# EAGLE design airrelay (EAGLE 6.4)

## Sheet 1 of 2
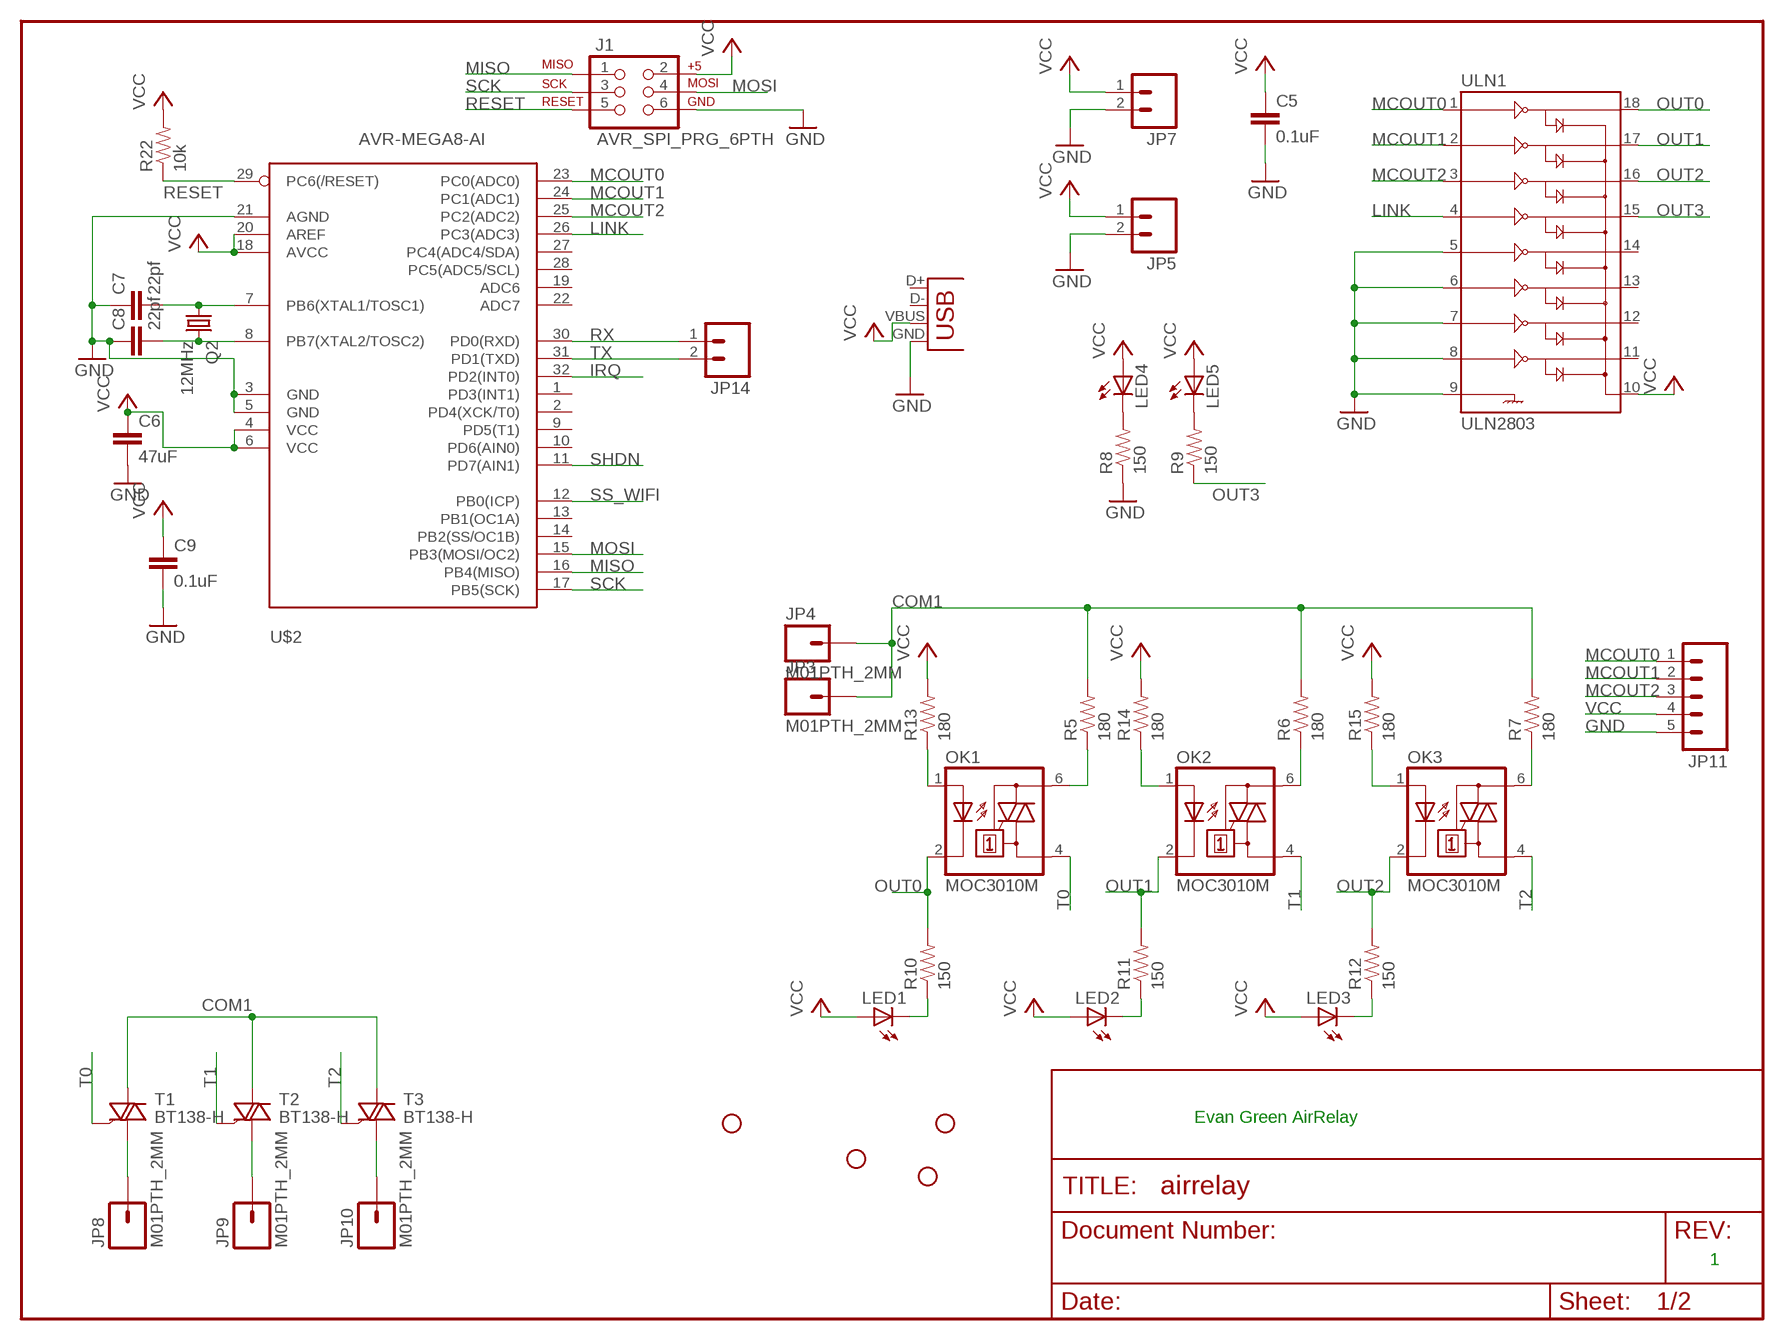
[diagram p0: schematic, sheet 1]

### Parts
C5  0.1uF  CAP0402-CAP  [0402-CAP]
C6  47uF  CAP1210  [1210]
C7  22pf  CAP0402-CAP  [0402-CAP]
C8  22pf  CAP0402-CAP  [0402-CAP]
C9  0.1uF  CAP0402-CAP  [0402-CAP]
J1  AVR_SPI_PRG_6PTH  [2X3]
JP2  STAND-OFF  [STAND-OFF]
JP3  M01PTH_2MM  [1X01_2MM]
JP4  M01PTH_2MM  [1X01_2MM]
JP5  M02PTH  [1X02]
JP6  STAND-OFF  [STAND-OFF]
JP7  M02PTH  [1X02]
JP8  M01PTH_2MM  [1X01_2MM]
JP9  M01PTH_2MM  [1X01_2MM]
JP10  M01PTH_2MM  [1X01_2MM]
JP11  M05PTH  [1X05]
JP12  STAND-OFF  [STAND-OFF]
JP13  STAND-OFF  [STAND-OFF]
JP14  M02PTH  [1X02]
LED1  LED5MM  [LED5MM]
LED2  LED5MM  [LED5MM]
LED3  LED5MM  [LED5MM]
LED4  LED3MM  [LED3MM]
LED5  LED3MM  [LED3MM]
OK1  MOC3010M  [DIL06]
OK2  MOC3010M  [DIL06]
OK3  MOC3010M  [DIL06]
Q2  12MHz  CRYSTALTC38H  [TC38H]
R5  180  RESISTORPTH-1/4W  [AXIAL-0.4]
R6  180  RESISTORPTH-1/4W  [AXIAL-0.4]
R7  180  RESISTORPTH-1/4W  [AXIAL-0.4]
R8  150  RESISTOR0402-RES  [0402-RES]
R9  150  RESISTOR0402-RES  [0402-RES]
R10  150  RESISTOR0402-RES  [0402-RES]
R11  150  RESISTOR0402-RES  [0402-RES]
R12  150  RESISTOR0402-RES  [0402-RES]
R13  180  RESISTOR0402-RES  [0402-RES]
R14  180  RESISTOR0402-RES  [0402-RES]
R15  180  RESISTOR0402-RES  [0402-RES]
R22  10k  RESISTOR0402-RES  [0402-RES]
T1  BT138-H  [TO220BH]
T2  BT138-H  [TO220BH]
T3  BT138-H  [TO220BH]
U$2  AVR-MEGA8-AI  [TQFP32-08]
ULN1  ULN2803  ULN2803SOICW  [SO18L]
X1  USBSMD  [USB-MINIB]

### Nets
COM1 [AC]: JP3.1 JP4.1 R5.P$2 R6.P$2 R7.P$2 T1.T2(A2) T2.T2(A2) T3.T2(A2)
GND: C5.2 C6.2 C7.1 C8.1 C9.2 J1.6 JP5.2 JP7.2 JP11.5 R8.1 U$2.3(GND) U$2.5(GND) U$2.21(AGND) ULN1.5 ULN1.6 ULN1.7 ULN1.8 ULN1.9 X1.GND ; also sheet 2
IRQ: U$2.32(PD2(INT0)) ; also sheet 2
LINK: U$2.26(PC3(ADC3)) ULN1.4
MCOUT0: JP11.1 U$2.23(PC0(ADC0)) ULN1.1
MCOUT1: JP11.2 U$2.24(PC1(ADC1)) ULN1.2
MCOUT2: JP11.3 U$2.25(PC2(ADC2)) ULN1.3
MISO: J1.1 U$2.16(PB4(MISO))
MOSI: J1.4 U$2.15(PB3(MOSI/OC2)) ; also sheet 2
N$1: OK1.1(A) R13.1
N$2: OK2.1(A) R14.1
N$3: OK3.1(A) R15.1
N$4: LED4.K(C) R8.2
N$5: LED5.K(C) R9.2
N$8: LED3.K(C) R12.1
N$9: OK1.6(A2) R5.P$1
N$10: OK2.6(A2) R6.P$1
N$11: OK3.6(A2) R7.P$1
N$14: LED2.K(C) R11.1
N$15: LED1.K(C) R10.1
N$16: C7.2 Q2.1 U$2.7(PB6(XTAL1/TOSC1))
N$21 [AC]: JP8.1 T1.T1(A1)
N$23 [AC]: JP9.1 T2.T1(A1)
N$24 [AC]: JP10.1 T3.T1(A1)
N$28: C8.2 Q2.2 U$2.8(PB7(XTAL2/TOSC2))
OUT0: OK1.2(C) R10.2 ULN1.18
OUT1: OK2.2(C) R11.2 ULN1.17
OUT2: OK3.2(C) R12.2 ULN1.16
OUT3: R9.1 ULN1.15
RESET: J1.5 R22.1 U$2.29(PC6(/RESET))
RX: JP14.1 U$2.30(PD0(RXD))
SCK: J1.3 U$2.17(PB5(SCK)) ; also sheet 2
SHDN: U$2.11(PD7(AIN1)) ; also sheet 2
SS_WIFI: U$2.12(PB0(ICP)) ; also sheet 2
T0: OK1.4(A1) T1.G
T1: OK2.4(A1) T2.G
T2: OK3.4(A1) T3.G
TX: JP14.2 U$2.31(PD1(TXD))
VCC: C5.1 C6.1 C9.1 J1.2 JP5.1 JP7.1 JP11.4 LED1.A LED2.A LED3.A LED4.A LED5.A R13.2 R14.2 R15.2 R22.2 U$2.4(VCC) U$2.6(VCC) U$2.18(AVCC) U$2.20(AREF) ULN1.10 X1.VBUS
Unconnected: U$2.1(PD3(INT1)) U$2.2(PD4(XCK/T0)) U$2.9(PD5(T1)) U$2.10(PD6(AIN0)) U$2.13(PB1(OC1A)) U$2.14(PB2(SS/OC1B)) U$2.19(ADC6) U$2.22(ADC7) U$2.27(PC4(ADC4/SDA)) U$2.28(PC5(ADC5/SCL)) ULN1.11 ULN1.12 ULN1.13 ULN1.14 X1.D+ X1.D-

### Notes on the sheet
- Evan Green AirRelay
- 1

## Sheet 2 of 2
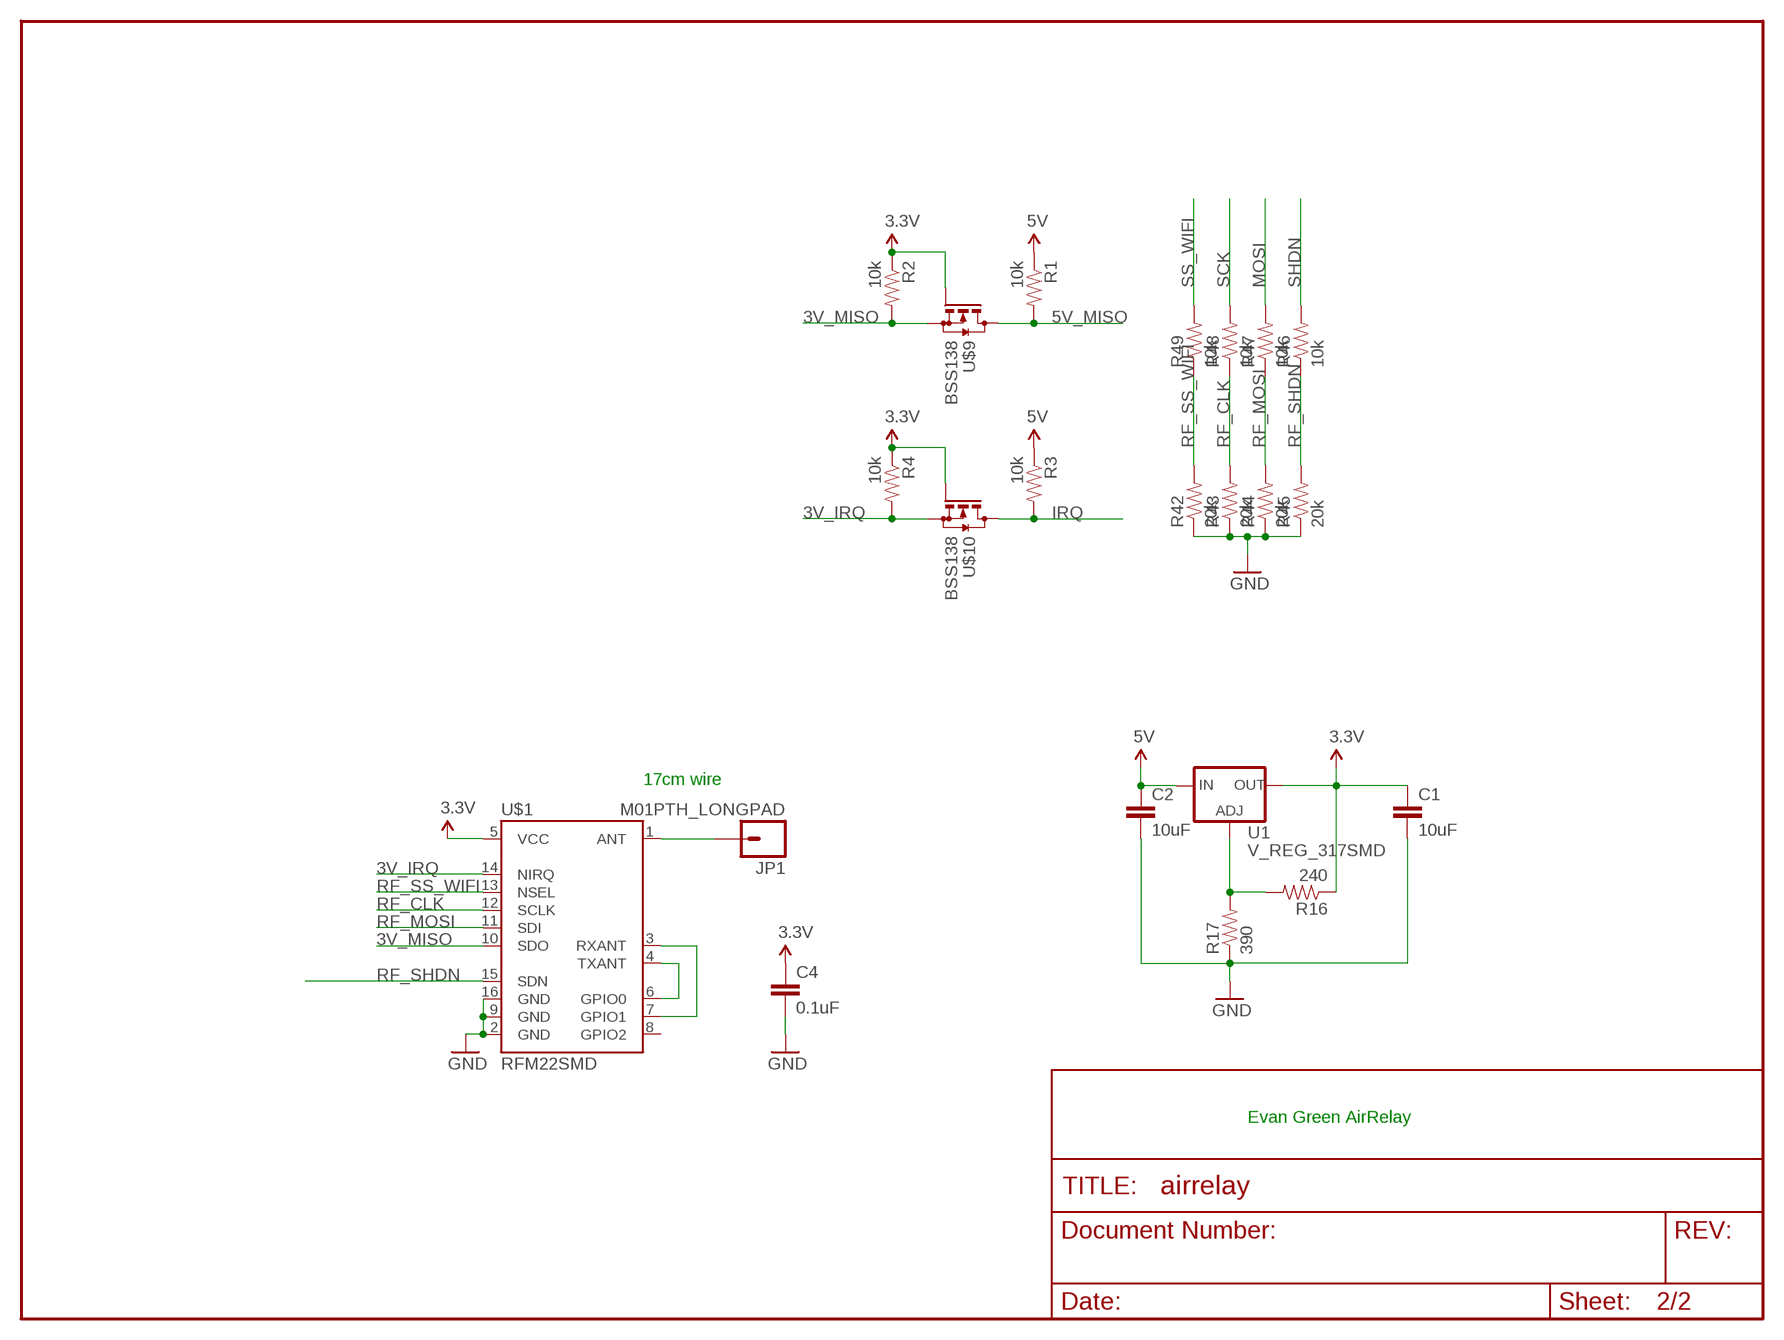
[diagram p1: schematic, sheet 2]

### Parts
C1  10uF  CAP0805  [0805]
C2  10uF  CAP0805  [0805]
C4  0.1uF  CAP0402-CAP  [0402-CAP]
JP1  M01PTH_LONGPAD  [1X01_LONGPAD]
R1  10k  RESISTOR0402-RES  [0402-RES]
R2  10k  RESISTOR0402-RES  [0402-RES]
R3  10k  RESISTOR0402-RES  [0402-RES]
R4  10k  RESISTOR0402-RES  [0402-RES]
R16  240  RESISTOR0402-RES  [0402-RES]
R17  390  RESISTOR0402-RES  [0402-RES]
R42  20k  RESISTOR0402-RES  [0402-RES]
R43  20k  RESISTOR0402-RES  [0402-RES]
R44  20k  RESISTOR0402-RES  [0402-RES]
R45  20k  RESISTOR0402-RES  [0402-RES]
R46  10k  RESISTOR0402-RES  [0402-RES]
R47  10k  RESISTOR0402-RES  [0402-RES]
R48  10k  RESISTOR0402-RES  [0402-RES]
R49  10k  RESISTOR0402-RES  [0402-RES]
U1  V_REG_317SMD  [SOT223]
U$1  RFM22SMD  [RFM22-XXX-S2]
U$9  BSS138  [SOT-323]
U$10  BSS138  [SOT-323]

### Nets
3.3V: C1.1 C4.1 R2.1 R4.1 R16.1 U1.2(OUT) U$1.5(VCC) U$9.1(G) U$10.1(G)
3V_IRQ: R4.2 U$1.14(NIRQ) U$10.2(S)
3V_MISO: R2.2 U$1.10(SDO) U$9.2(S)
5V: C2.1 R1.1 R3.1 U1.3(IN)
5V_MISO: R1.2 U$9.3(D)
GND: C1.2 C2.2 C4.2 R17.1 R42.1 R43.1 R44.1 R45.1 U$1.2(GND) U$1.9(GND) U$1.16(GND) ; also sheet 1
IRQ: R3.2 U$10.3(D) ; also sheet 1
MOSI: R47.2 ; also sheet 1
N$6: R16.2 R17.2 U1.1(ADJ)
N$7: U$1.4(TXANT) U$1.6(GPIO0)
N$12: JP1.1 U$1.1(ANT)
N$22: U$1.3(RXANT) U$1.7(GPIO1)
RF_CLK: R43.2 R48.1 U$1.12(SCLK)
RF_MOSI: R44.2 R47.1 U$1.11(SDI)
RF_SHDN: R45.2 R46.1 U$1.15(SDN)
RF_SS_WIFI: R42.2 R49.1 U$1.13(NSEL)
SCK: R48.2 ; also sheet 1
SHDN: R46.2 ; also sheet 1
SS_WIFI: R49.2 ; also sheet 1
Unconnected: U$1.8(GPIO2)

### Notes on the sheet
- 17cm wire
- Evan Green AirRelay

## Library data of the parts
C1 C2 C4-C9 = SparkFun:CAP: Capacitor Standard 0603 ceramic capacitor, and 0.1" leaded capacitor.
J1 = SparkFun:AVR_SPI_PRG_6: AVR ISP 6 Pin This is the reduced ISP connector for AVR programming. Common on Arduino. This footprint will take up less PCB space and can be used with a 10-pin to 6-pin adapter such as SKU: BOB-08508
JP1 JP3 JP4 JP8-JP10 = SparkFun:M01: Header 1 Standard 1-pin 0.1" header. Use with straight break away headers (SKU : PRT-00116), right angle break away headers (PRT-00553), swiss pins (PRT-00743), machine pins (PRT-00117), and female headers (PRT-00115).
JP2 JP6 JP12 JP13 = SparkFun:STAND-OFF: Stand Off This is the mechanical footprint for a #4 phillips button head screw. Use the keepout ring to avoid running the screw head into surrounding components. SKU : PRT-00447
JP5 JP7 JP14 = SparkFun:M02: Header 2 Standard 2-pin 0.1" header. Use with straight break away headers (SKU : PRT-00116), right angle break away headers (PRT-00553), swiss pins (PRT-00743), machine pins (PRT-00117), and female headers (PRT-00115). Molex polarized connector foot print use with SKU : PRT-08233 with associated crimp pins and housings.
JP11 = SparkFun:M05: Header 5 Standard 5-pin 0.1" header. Use with straight break away headers (SKU : PRT-00116), right angle break away headers (PRT-00553), swiss pins (PRT-00743), machine pins (PRT-00117), and female headers (PRT-00115). Molex polarized connector foot print use with SKU : PRT-08230 with associated crimp pins and housings.
LED1-LED5 = SparkFun:LED: LEDs Standard schematic elements and footprints for 5mm, 3mm, 1206, and 0603 sized LEDs. 5mm - Spark Fun Electronics SKU : COM-00529 (and others)
OK1-OK3 = optocoupler:MOC30*M: RANDOM-PHASE OPTOISOLATORS TRIAC DRIVER OUTPUT Source: http://www.fairchildsemi.com MOC3020-M.pdf; MF: FAIRCHILD SEMICONDUCTOR; MPN: MOC3010-M; OC_FARNELL: 1505423; OC_NEWARK: 72K8892
Q2 = SparkFun:CRYSTAL: Crystals Various standard crystals. Proven footprints. Spark Fun Electronics SKU : COM-00534
R1-R17 R22 R42-R49 = SparkFun:RESISTOR: Resistor Basic schematic elements and footprints for 0603, 1206, and PTH resistors.
T1-T3 = triac:BT138: TRIAC Source: http://www.semiconductors.philips.com BT138_SERIES_2.pdf
U1 = SparkFun:V_REG_317: Voltage Regulator Standard LM317 adjustable voltage regulator. AOI (Adjust Output Input). Google 'LM317 Calculator' for easy to use app to get the two resistor values needed. 240/720 for 5V output. 240/390 for 3.3V output. Spark Fun Electronics SKU : COM-00527
U$1 = SparkFun:RFM22: Description: The RFM22 is a low-power, low cost radio that is capable of operating in the 434MHz and 900MHz open bands. It's frequency is software defined and there are some very good libraries written for it.
U$2 = SparkFun:AVR-MEGA8: MICROCONTROLLER 8 Kbytes FLASH 1 kbytes SRAM 512 bytes EEPROM USART 6-channel 10 bit ADC 2-channel 8 bit ADC
U$9 U$10 = Evan:BSS138: BSS138W N-MOSFET Evan Green 7-Aug-2012
ULN1 = SparkFun:ULN2803: Darlington Driver ULN2803 Darlington array. 500mA max per channel, 8-channel package. Spark Fun Electronics SKU : COM-00312
X1 = SparkFun:USB: USB Connectors USB-B-PTH is fully proven SKU : PRT-00139 USB-miniB is fully proven SKU : PRT-00587 USB-A-PCB is untested. USB-A-H is throughly reviewed, but untested. Spark Fun Electronics SKU : PRT-00437 USB-B-SMT is throughly reviewed, but untested. Needs silkscreen touching up. USB-A-S has not been used/tested USB-MB-H has not been used/tested

## Net classes
1 AC: width 1.524 mm, clearance 0.508 mm

## Board
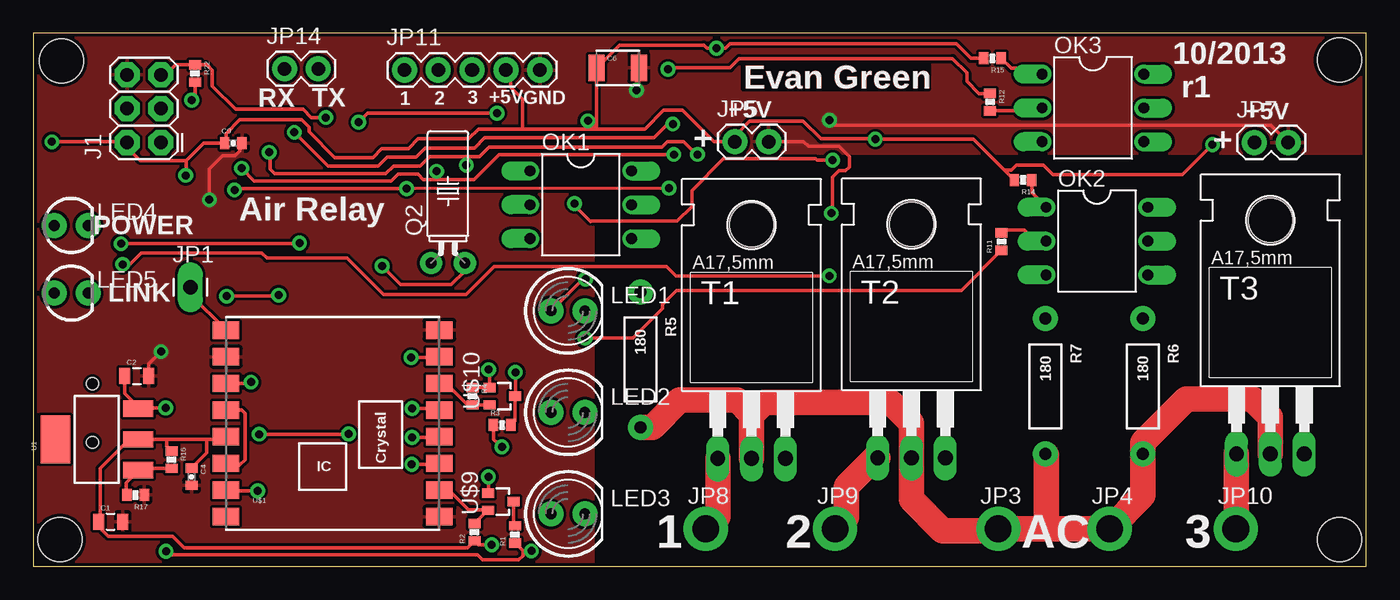
[diagram p2: board, top side]
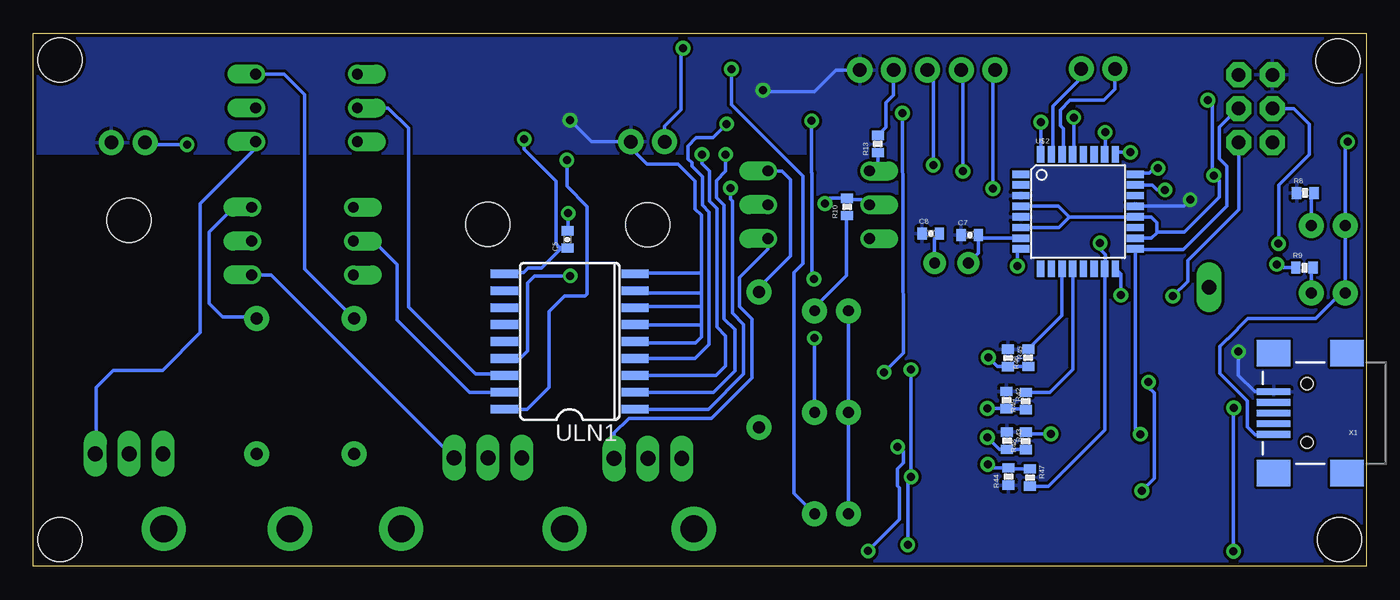
[diagram p3: board, bottom side, seen from below]

Size 100 x 40 mm. Coordinates in mm from the lower left corner, seen from the top.
Outline: 0,0 100,0 100,40 0,40 0,0
Copper layers (1*16): Top 0.035mm / dielectric 1.5mm / Bottom 0.035mm
Design rules "SparkFun": minimum track width 8mil, minimum drill 20mil, track to track 8mil, track to pad 8mil, pad to pad 8mil, via to via 8mil, smd to smd 8mil, copper to edge 10mil, drill to drill 8mil, minimum pad ring 12mil, minimum via ring 10mil, stop-mask expansion 4mil, vias tented up to drill 25mil, thermal gap 10mil

### Footprints (pad centres in the part's own frame; a part is rotated, then mirrored left to right if it is on the bottom)
0805 = smd 0.8 x 1.2: 1 -0.9,0; 2 0.9,0
0402-CAP = smd 0.7 x 0.9: 1 -0.65,0; 2 0.65,0
1210 = smd 1.2 x 2: 1 -1.6,0; 2 1.6,0
2X3 = drill 1.016 pad 1.88 octagon: 1 0,0; 2 0,2.54; 3 2.54,0; 4 2.54,2.54; 5 5.08,0; 6 5.08,2.54
1X01_LONGPAD = drill 1.118 pad 1.88 long: 1 0,0
STAND-OFF = hole 3.302: 0,0
1X01_2MM = drill 2 pad 3.302: 1 0,0
1X02 = drill 1.016 pad 1.88: 1 0,0; 2 2.54,0
1X05 = drill 1.016 pad 1.88: 1 0,0; 2 2.54,0; 3 5.08,0; 4 7.62,0; 5 10.16,0
LED5MM = drill 0.813 pad 1.88: A -1.27,0; K 1.27,0
LED3MM = drill 0.813 pad 1.88: A -1.27,0; K 1.27,0
DIL06 = drill 0.813 offset: 1 -2.54,-3.81; 2 0,-3.81; 3 2.54,-3.81; 4 2.54,3.81; 5 0,3.81; 6 -2.54,3.81
TC38H = drill 0.813 pad 1.676: 1 -1.27,0; 2 1.27,0
0402-RES = smd 0.7 x 0.9: 1 -0.65,0; 2 0.65,0
AXIAL-0.4 = drill 0.9 pad 1.88: P$1 -5.08,0; P$2 5.08,0
TO220BH = drill 1.118 long: G 2.54,-6.35; T1 -2.54,-6.35; T2 0,-6.35 | hole 3.302: 0,11.176
SOT223 = smd 1.219 x 2.235: 1 -2.311,-3.099; 2 0,-3.099; 3 2.311,-3.099 | smd 3.6 x 2.2: 4 0,3.099
RFM22-XXX-S2 = smd 2 x 1.3: 1 -8,7; 2 -8,5; 3 -8,3; 4 -8,1; 5 -8,-1; 6 -8,-3; 7 -8,-5; 8 -8,-7; 9 8,-7; 10 8,-5; 11 8,-3; 12 8,-1; 13 8,1; 14 8,3; 15 8,5; 16 8,7
TQFP32-08 = smd 1.27 x 0.559: 1 -4.293,2.8; 2 -4.293,2; 3 -4.293,1.2; 4 -4.293,0.4; 5 -4.293,-0.4; 6 -4.293,-1.2; 7 -4.293,-2; 8 -4.293,-2.8; 17 4.293,-2.8; 18 4.293,-2; 19 4.293,-1.2; 20 4.293,-0.4; 21 4.293,0.4; 22 4.293,1.2; 23 4.293,2; 24 4.293,2.8 | smd 0.559 x 1.27: 9 -2.8,-4.293; 10 -2,-4.293; 11 -1.2,-4.293; 12 -0.4,-4.293; 13 0.4,-4.293; 14 1.2,-4.293; 15 2,-4.293; 16 2.8,-4.293; 25 2.8,4.293; 26 2,4.293; 27 1.2,4.293; 28 0.4,4.293; 29 -0.4,4.293; 30 -1.2,4.293; 31 -2,4.293; 32 -2.8,4.293
SOT-323 = smd 0.7 x 0.9: 1 0.65,0.95; 2 -0.65,0.95; 3 0,-0.95
SO18L = smd 0.66 x 2.032: 1 -0.635,-4.902; 2 0.635,-4.902; 3 1.905,-4.902; 4 3.175,-4.902; 5 4.445,-4.902; 6 5.715,-4.902; 7 6.985,-4.902; 8 8.255,-4.902; 9 9.525,-4.902; 10 9.525,4.902; 11 8.255,4.902; 12 6.985,4.902; 13 5.715,4.902; 14 4.445,4.902; 15 3.175,4.902; 16 1.905,4.902; 17 0.635,4.902; 18 -0.635,4.902
USB-MINIB = smd 2.5 x 0.5: D+ 2.5,0; D- 2.5,0.8; GND 2.5,-1.6; ID 2.5,-0.8; VBUS 2.5,1.6 | smd 2.5 x 2: GND@1 -3,-4.5; GND@2 -3,4.5; GND@3 2.5,4.5; GND@4 2.5,-4.5 | hole 0.9: 0,2.2; 0,-2.2

### Placement (x,y rotation side)
C1  5.8,3.33 0 top
C2  7.76,14.26 0 top
C4  11.87,6.72 270 top
C5  59.94,24.53 90 bottom
C6  43.84,37.41 0 top
C7  29.74,24.87 0 bottom
C8  32.66,24.97 0 bottom
C9  15,31.75 0 top
J1  9.57,31.81 90 top
JP1  11.79,20.94 0 top
JP2  2,2 0 top
JP3  72.39,2.81 0 top
JP4  80.75,2.81 0 top
JP5  52.63,31.86 0 top
JP6  98,38 0 top
JP7  91.61,31.81 0 top
JP8  50.45,2.81 0 top
JP9  60.15,2.81 0 top
JP10  90.22,2.81 0 top
JP11  27.84,37.25 0 top
JP12  2.11,37.92 0 top
JP13  98,2 0 top
JP14  18.84,37.33 0 top
LED1  40.11,19.17 0 top
LED2  40.11,11.55 0 top
LED3  40.11,3.93 0 top
LED4  2.84,25.58 0 top
LED5  2.84,20.5 0 top
OK1  41.07,27.13 270 top
OK2  79.8,24.4 270 top
OK3  79.5,34.4 270 top
Q2  31.11,22.76 0 top
R1  36.13,2.39 90 top
R2  33.1,2.56 90 top
R3  35.17,10.59 0 top
R4  32.94,12.76 270 top
R5  45.55,15.51 270 top
R6  83.25,13.51 270 top
R7  75.94,13.51 270 top
R8  4.57,28.01 0 bottom
R9  4.63,22.42 0 bottom
R10  38.94,26.97 90 bottom
R11  72.65,24.37 90 top
R12  71.77,34.84 270 top
R13  36.64,31.7 90 bottom
R14  74.25,28.99 180 top
R15  71.96,38.13 180 top
R16  10.37,8 270 top
R17  7.68,5.35 180 top
R22  12.13,36.99 270 top
R42  26.99,12.47 270 bottom
R43  26.95,9.42 270 bottom
R44  26.84,6.73 90 bottom
R45  26.87,15.63 270 bottom
R46  25.35,15.65 90 bottom
R47  25.22,6.66 270 bottom
R48  25.53,9.4 90 bottom
R49  25.55,12.4 90 bottom
T1  53.89,14.44 0 top
T2  65.89,14.49 0 top
T3  92.81,14.79 0 top
U1  4.77,9.52 90 top
U$1  22.46,10.72 0 top
U$2  21.62,26.62 0 bottom
U$9  35.06,4.84 90 top
U$10  35.18,12.76 90 top
ULN1  59.76,12.42 90 bottom
X1  4.45,11.49 180 bottom

### Tracks (layer width: path | path; a pad name or v marks a point on that pad's centre or on a via)
3.3V  (via drill 0.6)
  Top 0.254: U$9.1 34.14,5.51 v34.14,6.71 | v34.16,14.76 34.23,14.7 U$10.1 R4.1 | U$1.5 14.26,9.52 13,9.52 | 13,9.52 10,9.52 | 10,9.52 U1.2 7.18,9.52 5,7.34 5,3.43 C1.1 | R16.1 10,9.02 10,9.52 | v34.39,1.6 33.41,1.6 R2.1 32.56,1.37 11.33,1.37 10.44,2.26 5.61,2.26 4.9,2.97 C1.1 | 4.9,2.89 C1.1 | C4.1 13,8.5 13,9.52
  Bottom 0.254: v34.16,14.76 34.16,6.73 v34.14,6.71 34.39,6.45 v34.39,1.6
3V_IRQ
  Top 0.254: U$10.2 R4.2 32.91,12.14 32.54,12.14 30.96,13.72 U$1.14
3V_MISO
  Top 0.254: R2.2 34.08,4.19 U$9.2 34.06,4.24 32.64,4.24 31.16,5.72 U$1.10
5V  (via drill 0.6)
  Top 0.254: R1.1 36.73,1.14 | 36.73,1.14 v37.36,1.14 | v35.15,8.97 34.52,9.5 R3.1 | U1.3 7.93,11.89 | 7.93,11.89 v9.93,11.89 | v9.96,1.12 10.21,0.86 33.33,0.86 33.71,0.48 36.42,0.48 36.73,0.78 36.73,1.14 | 7.93,11.89 6.86,12.95 C2.1
  Bottom 0.254: v37.36,1.14 35,3.5 35,5.89 35.15,6.04 35.15,7.32 34.72,7.75 34.72,8.64 v35.15,8.97 | v9.93,11.89 9.96,11.86 v9.96,1.12
5V_MISO
  Top 0.254: R1.2 36.02,3.15 U$9.3
COM1
  Top 1.93: 53.89,11.37 54.81,12.29 64.34,12.29 65.89,10.74 T2.T2 65.89,5 68.22,2.67 72.25,2.67 JP3.1 76,2.81 | 53.89,11.37 T1.T2 | 76,2.81 JP4.1 83.25,5.3 R6.P$2 83.25,9.28 86.51,12.55 91.47,12.55 92.81,11.2 T3.T2 | R7.P$2 76,8.38 76,2.81 | 53.89,11.37 52.79,12.47 48.49,12.47 46.45,10.43 R5.P$2
GND  (via drill 0.6)
  Top 0.254: v59.87,26.49 59.94,26.57 59.94,29.21 60.43,29.69 60.94,29.69 61.21,29.97 61.21,30.76 60.45,31.52 58.14,31.52 57.8,31.86 JP5.2 | JP7.2 92.84,33.12 60.05,33.12 59.74,33.43 v59.74,33.48 | C9.2 15.47,31.57 15.47,31.14 15.14,30.81 14.22,30.81 13.21,29.79 v13.21,27.51 | v9.58,16.1 8.66,15.19 C2.2 | C6.2 45.26,37.23 v45.26,35.74
  Bottom 0.254: C5.2 59.87,25.25 v59.87,26.49 | 55.03,22.12 ULN1.9 54.8,22 49.86,22 | ULN1.5 54.75,16.76 50.32,16.76 49.86,17.22 49.86,18.11 | 49.86,18.11 49.86,19.48 | 49.86,19.48 49.86,20.52 | 49.86,20.52 49.86,22 | 49.86,22 49.86,26.34 50.34,26.82 50.34,28.91 51.61,30.18 53.95,30.18 55.17,31.4 JP5.2 58.13,31.86 v59.74,33.48 | ULN1.8 54.7,20.52 49.86,20.52 | ULN1.7 54.78,19.48 49.86,19.48 | ULN1.6 54.83,18.11 49.86,18.11 | v13.21,27.51 13.7,27.02 U$2.21 | X1.GND 6.96,13.11 8.36,13.11 9.58,14.33 v9.58,16.1 | v45.26,35.74 45.14,35.61 41.4,35.61 39.76,37.25 JP11.5
  pour Bottom: 0,0 42,0 42,31 100,31 100,40 0,40
  pour Top: 0,0 42,0 42,31 100,31 100,40 0,40
IRQ  (via drill 0.6)
  Top 0.254: R3.2 36.13,10.9 U$10.3 36.17,12.8 v36.17,14.55 | v24.41,33.33 25.09,34.01 v34.8,34.01
  Bottom 0.254: v24.41,33.33 v24.42,33.31 U$2.32 | v36.17,14.55 34.72,16 v34.8,34.01
LINK  (via drill 0.6)
  Top 0.254: v19.58,32.56 22.12,30.02 25.86,30.02 26.54,30.71 28.7,30.71 29.39,31.39 33.1,31.39 33.86,32.16 46.56,32.16 47.6,33.2 v47.98,33.2
  Bottom 0.254: U$2.26 19.58,30.95 v19.58,32.56 | v47.98,33.2 49.02,32.16 50.27,32.16 50.88,31.55 50.88,30.56 50.6,30.28 50.6,30.05 49.81,29.26 49.81,27.1 49.3,26.59 49.3,16.64 50.34,15.6 ULN1.4
MCOUT0  (via drill 0.6)
  Top 0.254: v15.09,28.25 15.19,28.35 v28,28.35 v47.7,28.37
  Bottom 0.254: U$2.23 17.31,28.6 16.03,28.6 15.67,28.25 v15.09,28.25 | ULN1.1 49.35,11.79 46.71,14.43 46.71,18.16 47.55,19 47.55,27.41 47.7,27.56 v47.7,28.37 | JP11.1 28,37.09 v28,28.35
MCOUT1  (via drill 0.6)
  Top 0.254: v15.62,29.87 16.59,28.91 26.85,28.91 27.36,29.41 28.88,29.41 29.26,29.03 30.25,29.03 | 30.25,29.03 33.07,29.03 34.95,30.91 v48.06,30.91 | v30.25,29.64 30.25,29.03
  Bottom 0.254: U$2.24 17.26,29.49 16.26,29.49 15.88,29.87 v15.62,29.87 | ULN1.2 48.97,13.06 47.37,14.66 47.37,17.75 48.18,18.57 48.18,27.1 48.74,27.66 48.74,28.96 48.06,29.64 v48.06,30.91 | JP11.2 30.25,37.12 v30.25,29.64
MCOUT2  (via drill 0.6)
  Top 0.254: v17.7,31.06 17.75,31.01 17.75,29.82 18.11,29.46 26.44,29.46 27.03,30.05 29.03,30.05 29.74,30.76 32.36,30.76 | 32.36,30.76 33.48,30.76 34.19,31.47 47.17,31.47 47.57,31.88 48.79,31.88 49.76,30.91 v49.84,30.91 | v32.49,30.1 32.36,30.23 32.36,30.76
  Bottom 0.254: U$2.25 18.67,31.06 v17.7,31.06 | JP11.3 32.49,36.82 v32.49,30.1 | ULN1.3 48.77,14.33 48.06,15.04 48.06,17.3 48.72,17.96 48.72,26.85 49.28,27.41 49.28,29.67 49.84,30.23 v49.84,30.91
MISO  (via drill 0.6)
  Top 0.254: v18.41,20.34 18.34,20.27 v14.5,20.27
  Bottom 0.254: U$2.16 18.41,21.92 v18.41,20.34 | v14.5,20.27 13.39,21.39 13.39,22.94 9.57,26.75 J1.1
MOSI  (via drill 0.6)
  Top 0.254: v19.96,24.26 19.91,24.21 v6.58,24.21
  Bottom 0.254: v19.96,24.26 19.96,23.8 19.56,23.39 19.56,22.39 U$2.15 19.62,10.22 23.83,6.01 R47.2 | v6.58,24.21 6.55,24.23 6.55,28.6 4.27,30.89 4.27,33.17 5.45,34.35 J1.4
N$1
  Bottom 0.254: OK1.1 36.64,30.29 R13.1
N$2
  Top 0.254: OK2.1 74.9,28.03 R14.1
N$3
  Top 0.254: OK3.1 75.26,37.37 73.37,37.37 R15.1
N$4
  Bottom 0.254: R8.2 4.11,27.82 LED4.K
N$5
  Bottom 0.254: R9.2 4.11,22.29 LED5.K
N$6
  Top 0.254: R17.2 6.99,5.39 6.99,6.27 7.87,7.16 U1.1 8.01,7.35 R16.2
N$7
  Top 0.254: U$1.6 14.59,7.59 15.49,7.59 15.88,7.98 15.88,11.48 15.64,11.72 U$1.4
N$8  (via drill 0.6)
  Top 0.254: v47.62,37.31 47.73,37.41 52.27,37.41 52.96,38.1 68.96,38.1 70.03,37.03 70.03,36.4 70.94,35.49 R12.1
  Bottom 0.254: LED3.K 42.93,5.48 42.93,22.05 42.27,22.71 42.27,29.29 47.62,34.65 v47.62,37.31
N$9
  Bottom 0.254: OK1.6 43.84,29.67 43.18,29.01 43.18,23.29 45.55,20.93 R5.P$1
N$10
  Bottom 0.254: R6.P$1 83.38,18.72 85.8,18.72 86.82,19.74 86.82,25.07 84.95,26.94 OK2.6
N$11
  Bottom 0.254: R7.P$1 79.65,22.3 79.65,35.41 81.19,36.94 OK3.6
N$12
  Top 0.254: U$1.1 11.79,20.39 JP1.1
N$14  (via drill 0.6)
  Top 0.254: R11.1 69.63,20.7 48.26,20.7 47.19,19.63 47.19,19.33 44.98,17.12 v41.4,17.12
  Bottom 0.254: v41.4,17.12 41.38,17.1 LED2.K
N$15
  Bottom 0.254: R10.1 38.99,26.27 38.99,21.82 41.38,19.43 LED1.K
N$16
  Bottom 0.254: Q2.1 29.09,23.51 C7.2 28.85,24.62 U$2.7
N$21
  Top 1.93: JP8.1 51.35,3.71 T1.T1
N$22  (via drill 0.6)
  Top 0.254: U$1.7 14.52,5.66 v16.84,5.66 | v16.33,13.82 16.23,13.72 U$1.3
  Bottom 0.254: v16.84,5.66 15.9,6.6 15.9,13.01 16.33,13.44 v16.33,13.82
N$23
  Top 1.93: JP9.1 61,3.66 61,6 63.14,8.14 T2.T1
N$24
  Top 1.93: JP10.1 90.27,2.87 T3.T1
N$28  (via drill 0.6)
  Top 0.254: v26.16,22.53 27.56,21.13 31.34,21.13 32.38,22.17 Q2.2
  Bottom 0.254: U$2.8 26.16,23.57 v26.16,22.53 | C8.2 32.38,24.6 Q2.2
OUT0  (via drill 0.6)
  Top 0.254: v40.62,27.23 40.62,27.08 41.81,25.88 41.83,25.91 48.31,25.91 49.4,27 49.4,28.19 51.79,30.58 58.67,30.58 58.78,30.48 v59.97,30.48
  Bottom 0.254: ULN1.18 64.64,11.76 62.97,11.76 61.32,13.41 61.32,19.13 60.15,20.3 58.6,20.3 58.45,20.45 58.45,27 59.97,28.52 v59.97,30.48 | v40.62,27.23 40.23,27.62 R10.2 38.86,27.53 37.87,27.53 37.47,27.13 OK1.2
OUT1
  Top 0.254: R11.2 72.85,25.22 74.37,25.22 75.19,24.4 OK2.2
  Bottom 0.254: ULN1.17 64.69,13.03 67.28,13.03 72.72,18.47 72.72,22.66 74.46,24.4 OK2.2
OUT2
  Top 0.254: OK3.2 75.48,34.19 R12.2
  Bottom 0.254: ULN1.16 64.76,14.43 66.83,14.43 71.86,19.46 71.86,32.89 73.36,34.4 OK3.2
OUT3  (via drill 0.6)
  Top 0.254: v59.72,21.79 59.69,21.77 48.23,21.77 47.5,22.5 34.57,22.5 32.46,20.4 26.26,20.4 23.55,23.11 17.53,23.11 17.12,23.52 8.1,23.52 7.24,22.66 v6.71,22.66
  Bottom 0.254: ULN1.15 64.48,15.42 63.65,15.42 62.92,16.15 62.92,21.26 62.38,21.79 v59.72,21.79 | v6.71,22.66 6.46,22.41 R9.1
RESET  (via drill 0.6)
  Top 0.254: J1.5 9.94,36.89 10.69,37.64 R22.1 13.04,37.64 13.44,37.24 13.44,36.02 15.16,34.29 20.24,34.29 20.85,33.68 v21.95,33.68
  Bottom 0.254: U$2.29 21.95,30.99 v21.95,33.68
RF_CLK  (via drill 0.6)
  Top 0.254: U$1.12 30.42,9.68 v28.42,9.68
  Bottom 0.254: v28.42,9.68 27.52,8.77 R43.2 26.93,8.75 R48.1
RF_MOSI  (via drill 0.6)
  Top 0.254: U$1.11 30.39,7.64 v28.4,7.64
  Bottom 0.254: v28.4,7.64 28.14,7.38 R44.2 26.77,7.31 R47.1
RF_SHDN  (via drill 0.6)
  Top 0.254: U$1.15 30.41,15.67 v28.35,15.67
  Bottom 0.254: v28.35,15.67 27.66,14.98 R45.2 26.86,15 R46.1
RF_SS_WIFI  (via drill 0.6)
  Top 0.254: U$1.13 30.34,11.84 v28.42,11.84
  Bottom 0.254: v28.42,11.84 27,11.84 R42.2 25.62,11.82 R49.1
RX
  Bottom 0.254: U$2.30 22.73,31 22.73,32.84 22.96,33.07 22.96,34.24 22.23,34.98 19.68,34.98 18.84,35.82 JP14.1
SCK  (via drill 0.6)
  Top 0.254: v23.65,9.93 23.62,9.91 v16.94,9.91
  Bottom 0.254: R48.2 25.41,9.93 v23.65,9.93 | v16.94,9.91 17.33,10.29 U$2.17 17.28,23.77 13.72,23.77 10.46,27.03 10.46,30.05 11.02,30.61 11.02,32.97 9.64,34.35 J1.3
SHDN
  Bottom 0.254: R46.2 22.82,18.83 U$2.11
SS_WIFI
  Bottom 0.254: U$2.12 22.02,14.76 23.73,13.05 R49.2
T0
  Bottom 0.254: T1.G 56.43,9.99 55.32,11.1 49.12,11.1 46.08,14.15 46.08,18.54 47.02,19.48 47.02,21.67 44.88,23.8 OK1.4
T1
  Bottom 0.254: T2.G 82.15,21.86 OK2.4
T2
  Bottom 0.254: T3.G 95.28,8.51 95.28,13.44 94,14.71 90.3,14.71 87.48,17.53 87.48,27.2 83.31,31.37 OK3.4
TX
  Bottom 0.254: U$2.31 23.5,31.04 23.5,34.54 21.38,36.66 JP14.2
VCC  (via drill 0.6)
  Top 0.254: v1.4,31.85 6.99,31.85 J1.2 7.03,31.45 8.03,30.45 11.48,30.45 | v11.43,29.34 11.48,29.39 11.48,30.45 | v11.89,34.98 12.13,35.22 R22.2 | 11.48,30.45 12.78,31.75 C9.1 14.48,31.62 14.45,31.65 14.45,32.49 15.49,33.53 20.12,33.53 20.68,32.97 20.68,32.61 22.61,30.68 25.48,30.68 26.14,31.34 28.14,31.34 28.88,32.08 32.66,32.08 33.4,32.82 36.7,32.82 | 42.21,32.82 45.9,32.82 47.3,34.21 48.72,34.21 51.07,31.86 JP5.1 52.63,32.29 53.75,33.4 57.76,33.4 59.08,32.08 63.14,32.08 v63.17,32.05 70.53,32.05 72.87,29.72 | 42.21,32.82 36.7,32.82 | 42.21,32.82 42.24,32.84 42.24,33.02 | 42.24,33.02 C6.1 | JP11.4 35.79,36.92 35.79,35.97 36.7,35.05 36.7,32.82 | 42,37 42,37.02 42.22,37.24 42.22,37.34 43.99,39.12 50.32,39.12 50.55,38.89 v51.26,38.89 51.94,38.89 52.27,39.22 69.25,39.22 70.34,38.13 R15.2 | R14.2 72.87,29.72 | LED1.A 41.23,21.57 v41.43,21.57 | v41.6,33.43 42.01,33.02 42.24,33.02 | v88.47,31.65 86.21,29.39 76.5,29.39 75.79,30.1 73.76,30.1 73.38,29.72 72.87,29.72
  Bottom 0.254: X1.VBUS 6.99,9.86 8.31,9.86 8.91,10.46 8.91,12.39 10.97,14.45 10.97,16.51 10.41,17.07 10.39,17.07 8.87,18.59 3.79,18.59 1.88,20.5 LED5.A LED4.A 1.57,31.68 v1.4,31.85 | U$2.18 16.1,24.61 15.72,24.99 | 15.72,24.99 15.72,25.81 16.14,26.22 U$2.20 22.28,26.21 | 15.72,24.99 15.62,25.09 13.64,25.09 11.02,27.71 11.02,28.98 11.38,29.34 v11.43,29.34 11.53,29.44 11.53,34.7 11.81,34.98 v11.89,34.98 | 22.28,26.21 23.07,25.42 U$2.6 | 22.28,26.21 23.08,27.02 U$2.4 | ULN1.10 64.56,22.05 63.22,22.05 62.89,22.38 61.87,22.38 60.38,23.88 C5.1 59.99,23.93 60.5,23.93 60.78,24.21 60.78,28.91 63.17,31.29 v63.17,32.05 | v41.43,21.57 41.58,21.72 41.58,29.52 41.6,29.54 v41.6,33.43 | LED1.A LED2.A LED3.A | JP7.1 91.45,31.65 v88.47,31.65 | R13.2 36.02,32.97 36.02,34.8 35.46,35.35 JP11.4 | v51.26,38.89 51.41,38.73 51.41,34.27 52.63,33.04 JP5.1

### Text on the board
Top: Evan Green
tPlace: RX | TX | 1 | 2 | 3 | +5V | GND | Evan Green | +5V | 10/2013 / r1 | +5V | + | + | POWER | Air Relay | LINK | 1 | 2 | AC | 3